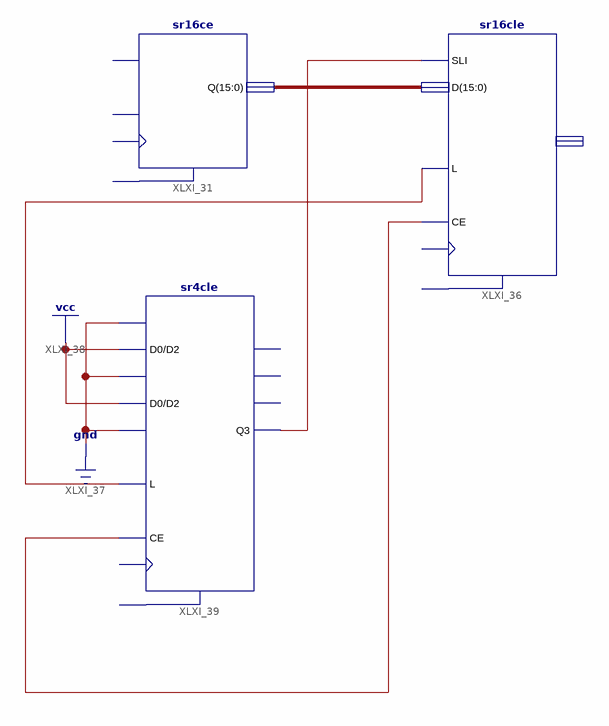
[diagram p0: schematic sheet 1]
// Xilinx ISE schematic SCH.sch (xc9500xl) as structural Verilog: 3 symbols, 0 ports
module SCH (
);

  wire XLXN_21, XLXN_23, XLXN_26;
  wire [15:0] XLXN_20;

  sr16ce XLXI_31 (.Q(XLXN_20));  // open: C, CE, CLR, SLI
  sr16cle XLXI_36 (.CE(XLXN_26), .D(XLXN_20), .L(XLXN_23), .SLI(XLXN_21));  // open: C, CLR, Q
  sr4cle XLXI_39 (
    .CE(XLXN_26), .D0(1'b1), .D1(1'b0), .D2(1'b1), .D3(1'b0), .L(XLXN_23), .SLI(1'b0), .Q3(XLXN_21));  // open: C, CLR, Q0, Q1, Q2
endmodule
